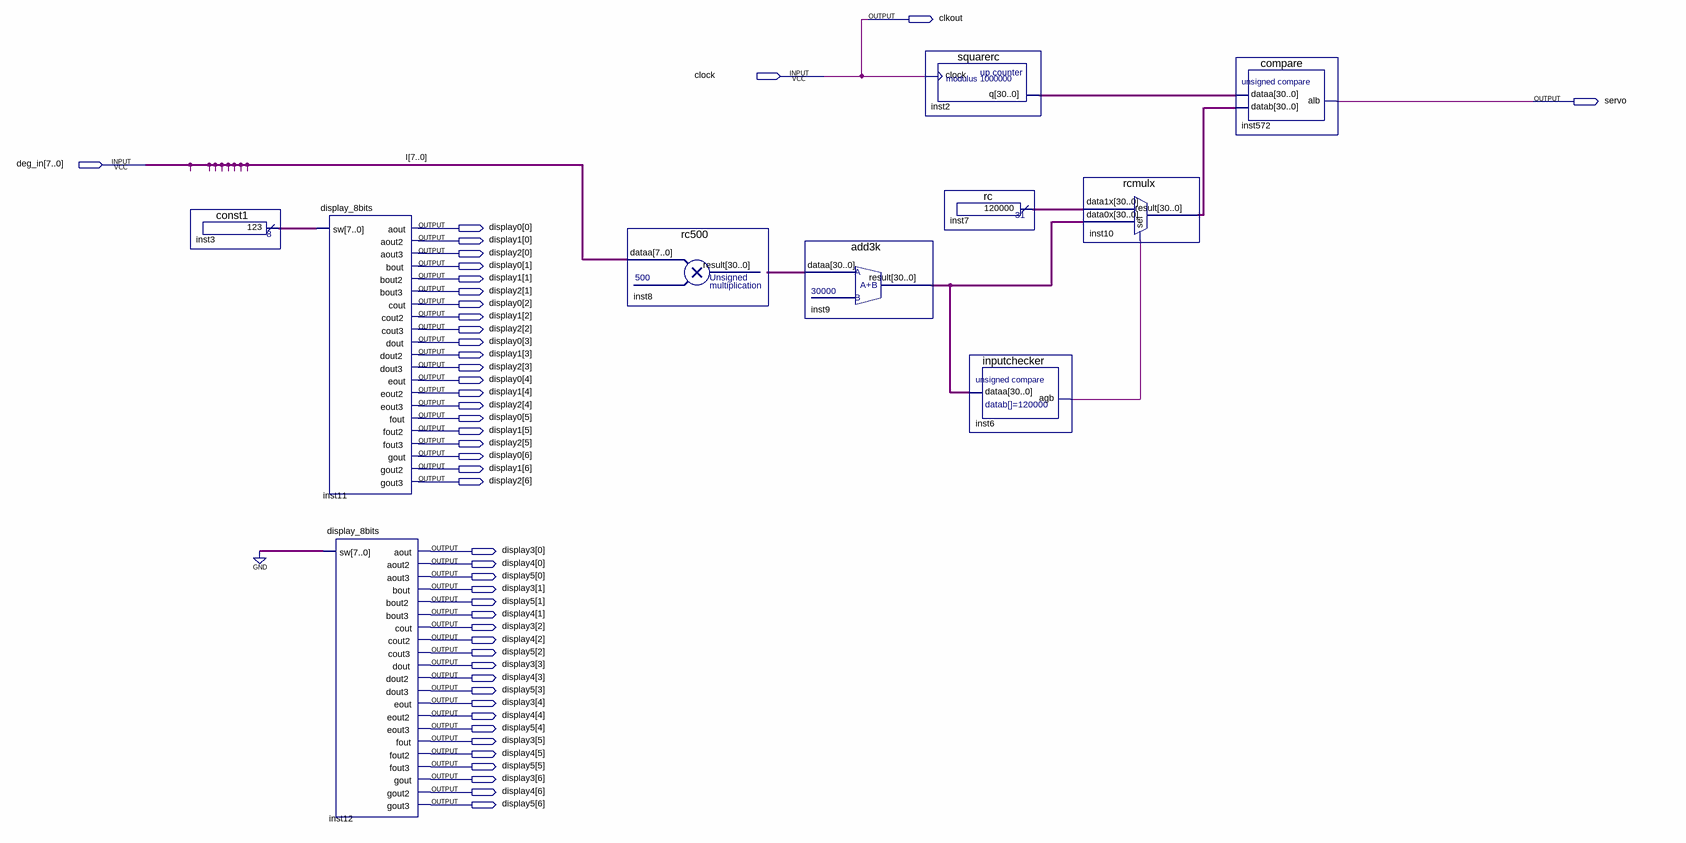
[diagram p0: schematic sheet]
// Quartus schematic rc_servo.bdf as structural Verilog: 10 symbols, 46 pins
module rc_servo (
  input  clock,
  input  [7:0] deg_in,
  output clkout,
  output servo,
  output [6:0] display0,
  output [6:0] display1,
  output [6:0] display2,
  output [6:0] display3,
  output [6:0] display4,
  output [6:0] display5
);

  wire inst6_agb;
  wire [7:0] inst3_result;
  wire [30:0] inst2_q, inst7_result, inst8_result, inst9_result, inst10_result;

  const1 inst3 (.result(inst3_result));
  display_8bits inst11 (
    .sw(inst3_result), .aout2(display1[0]));  // open: aout, aout3, bout, bout2, bout3, cout, cout2, cout3, dout, dout2, dout3, eout, eout2, eout3, fout, fout2, fout3, gout, gout2, gout3
  display_8bits inst12 (
    .sw({8{1'b0}}), .aout(display3[0]), .aout2(display4[0]), .aout3(display5[0]), .bout(display3[1]),
    .bout2(display5[1]), .bout3(display4[1]), .cout(display3[2]), .cout2(display4[2]), .cout3(display5[2]),
    .dout(display3[3]), .dout2(display4[3]), .dout3(display5[3]), .eout(display3[4]), .eout2(display4[4]),
    .eout3(display5[4]), .fout(display3[5]), .fout2(display4[5]), .fout3(display5[5]), .gout(display3[6]),
    .gout2(display4[6]), .gout3(display5[6]));
  rc500 inst8 (.dataa(deg_in), .result(inst8_result));
  add3k inst9 (.dataa(inst8_result), .result(inst9_result));
  squarerc inst2 (.clock(clock), .q(inst2_q));
  rc inst7 (.result(inst7_result));
  inputchecker inst6 (.dataa(inst9_result), .agb(inst6_agb));
  rcmulx inst10 (.data1x(inst7_result), .data0x(inst9_result), .sel(inst6_agb), .result(inst10_result));
  compare inst572 (.dataa(inst2_q), .datab(inst10_result), .alb(servo));

  assign clkout = clock;

  // Other names for the same wires on the sheet: I[7:0] = deg_in
endmodule
